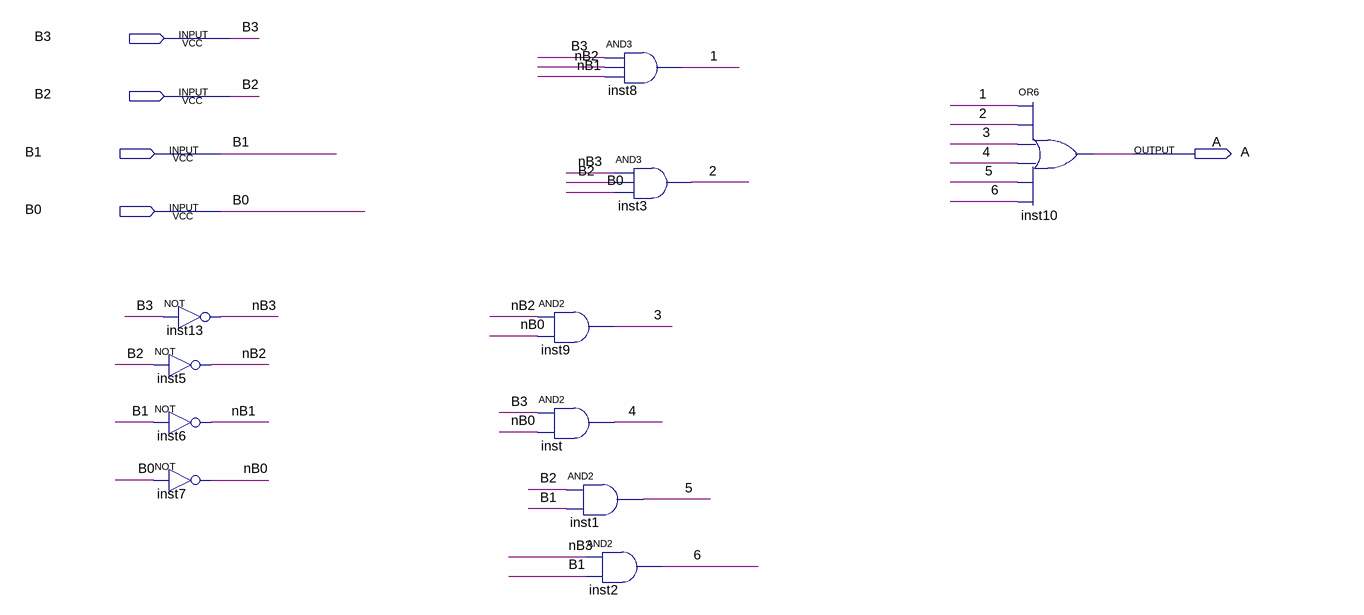
[diagram p0: schematic sheet]
// Quartus schematic A.bdf as structural Verilog: 11 symbols, 5 pins
module A (
  input  B3,
  input  B2,
  input  B1,
  input  B0,
  output A
);

  wire \1 , \2 , \3 , \4 , \5 , \6 , nB0, nB1, nB2, nB3;

  not inst13 (nB3, B3);
  not inst5 (nB2, B2);
  not inst6 (nB1, B1);
  not inst7 (nB0, B0);
  and inst9 (\3 , nB2, nB0);
  and inst (\4 , B3, nB0);
  and inst1 (\5 , B2, B1);
  and inst8 (\1 , B3, nB2, nB1);
  and inst3 (\2 , nB3, B2, B0);
  and inst2 (\6 , nB3, B1);
  or inst10 (A, \1 , \2 , \3 , \4 , \5 , \6 );
endmodule
